# EAGLE design 2016 Vehicle Pedal and Dash Controller (EAGLE 7.6.0)
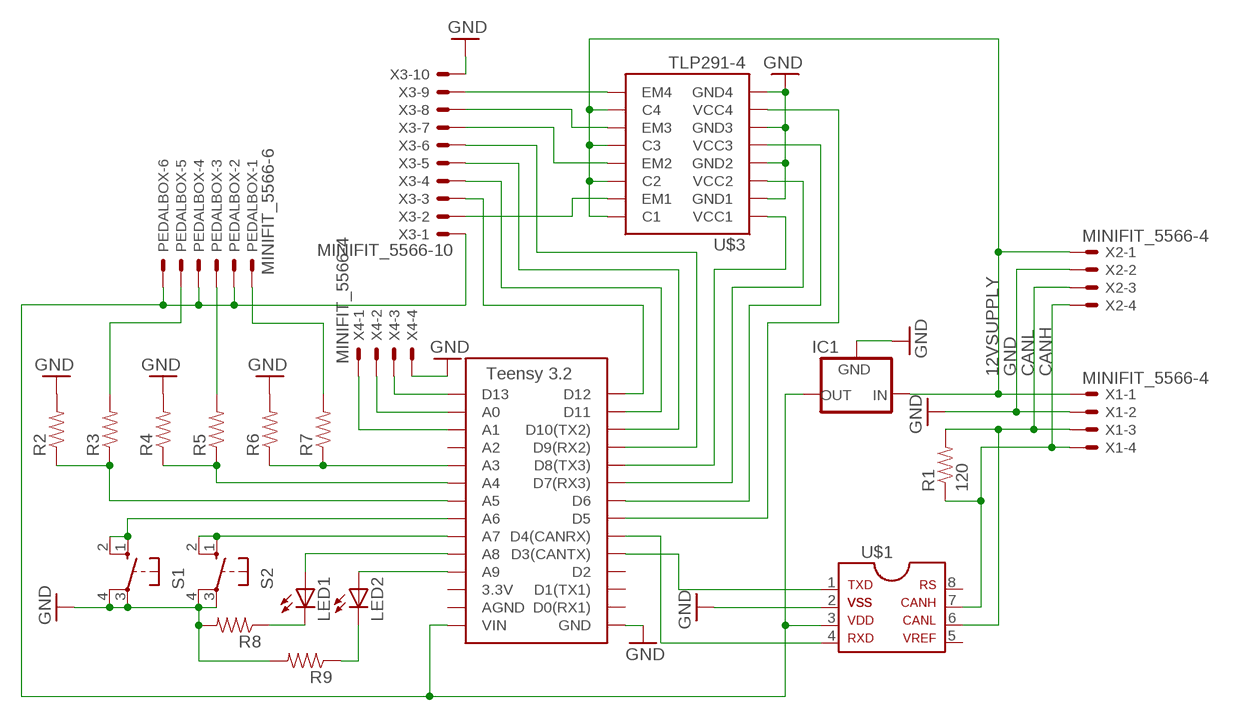
[diagram p0: schematic, sheet 1]

## Parts
IC1  5V_REGULATOR_LM340-NLM340MPX-5.0/NOPB  [SOT223]
LED1  LED-0805  [LED-805]
LED2  LED-0805  [LED-805]
PEDALBOX  MINIFIT_5566-6  [MINIFIT_5566-6]
R1  120  RESISTOR0805-RES  [0805]
R2  RESISTOR0805-RES  [0805]
R3  RESISTOR0805-RES  [0805]
R4  RESISTOR0805-RES  [0805]
R5  RESISTOR0805-RES  [0805]
R6  RESISTOR0805-RES  [0805]
R7  RESISTOR0805-RES  [0805]
R8  RESISTOR0805-RES  [0805]
R9  RESISTOR0805-RES  [0805]
S1  BTN_10-XX  [B3F-10XX]
S2  BTN_10-XX  [B3F-10XX]
U$1  MCP2551  [SOIC-08]
U$2  TEENSY_3.2_SIMPLE  [TEENSY_3.2_SIMPLE]
U$3  TLP291-4  [SOIC-16]
X1  MINIFIT_5566-4  [MINIFIT_5566-4]
X2  MINIFIT_5566-4  [MINIFIT_5566-4]
X3  MINIFIT_5566-10  [MINIFIT_5566-10]
X4  MINIFIT_5566-4  [MINIFIT_5566-4]

## Nets
12VSUPPLY: IC1.1(IN) U$3.10(C4) U$3.12(C3) U$3.14(C2) U$3.16(C1) X1.1 X2.1
CANH: R1.1 U$1.7 X1.4 X2.4
CANL: R1.2 U$1.6 X1.3 X2.3
GND: IC1.2(GND) IC1.4(GND) R2.2 R4.2 R6.2 R8.2 R9.2 S1.3(P) S1.4(P1) S2.3(P) S2.4(P1) U$1.2 U$2.GND U$3.2(GND1) U$3.4(GND2) U$3.6(GND3) U$3.8(GND4) X1.2 X2.2 X3.10 X4.4
N$1: U$2.D12 X3.3
N$2: IC1.3(OUT) PEDALBOX.2 PEDALBOX.4 PEDALBOX.6 U$1.3 U$2.VIN X3.1
N$3: PEDALBOX.5 R3.2
N$4: PEDALBOX.3 R5.2
N$5: U$1.1 U$2.D3(CANTX)
N$6: U$1.4 U$2.D4(CANRX)
N$7: PEDALBOX.1 R7.2
N$8: R2.1 R3.1 U$2.A5
N$9: R4.1 R5.1 U$2.A4
N$10: R6.1 R7.1 U$2.A3
N$11: U$2.D11 X3.4
N$12: U$2.D10(TX2) X3.5
N$13: U$2.D9(RX2) X3.6
N$14: U$2.D8(TX3) U$3.1(VCC1)
N$15: U$3.9(EM4) X3.9
N$16: U$3.11(EM3) X3.8
N$17: U$3.13(EM2) X3.7
N$18: U$3.15(EM1) X3.2
N$19: U$2.D7(RX3) U$3.3(VCC2)
N$20: U$2.D6 U$3.5(VCC3)
N$21: U$2.D5 U$3.7(VCC4)
N$22: S1.1(S) S1.2(S1) U$2.A6
N$23: S2.1(S) S2.2(S1) U$2.A7
N$24: LED1.A U$2.A8
N$25: LED2.A U$2.A9
N$26: LED1.C R8.1
N$27: LED2.C R9.1
N$28: U$2.D13 X4.3
N$29: U$2.A0 X4.2
N$30: U$2.A1 X4.1
Unconnected: U$1.5 U$1.8 U$2.3.3V U$2.A2 U$2.AGND U$2.D0(RX1) U$2.D1(TX1) U$2.D2

## Library data of the parts
IC1 = HyTechDevices:5V_REGULATOR_LM340-N: Voltage Regulator 5v linear voltage regulator Datasheet <http://www.mouser.com/ProductDetail/Texas-Instruments/LM340MPX-50-NOPB/?qs=X1J7HmVL2ZGZwtTFRQ9ItA%3D%3D> MAX current out: 1.5A MAX voltage in: 35V
LED1 LED2 = HyTechDevices:LED: Light Emitting Diode Source: Dangerous Prototypes Eagle Library <https://github.com/DangerousPrototypes/Eagle_Part_Library>
PEDALBOX = HyTechDevices:MINIFIT_5566-6: Mini FIT Junior connector 6 pole Source: http://www.molex.com; MPN: 95566-61002; OC_FARNELL: unknown; OC_NEWARK: 22K8620
R1-R9 = HyTechDevices:RESISTOR: Resistor Basic schematic elements and footprints for 0603, 1206, and PTH resistors.
S1 S2 = HyTechDevices:BTN_10-XX: OMRON SWITCH; MPN: B3F-1000; OC_FARNELL: 176432; OC_NEWARK: 36M3542
U$1 = HyTechDevices:MCP2551: MCP2551 High-Speed CAN Transceiver Product Webpage <https://www.microchip.com/wwwproducts/en/MCP2551> Datasheet <http://ww1.microchip.com/downloads/en/DeviceDoc/21667f.pdf> This device is outdated It is replaced by MCP2561. Comparison Page <https://www.microchip.com/wwwproducts/ProductCompare/MCP2551/MCP2561> Product Webpage <https://www.microchip.com/wwwproducts/en/MCP2561> Datasheet <http://ww1.microchip.com/downloads/en/DeviceDoc/20005167C.pdf>
U$2 = HyTechDevices:TEENSY_3.2_SIMPLE: Simple version of the Teensy 3.2 board that only uses the 2 main rows of pins, not the inner pins or the pins opposite the usb port.
U$3 = HyTechDevices:TLP291-4: Toshiba Quad Channel Optocoupler TLP291-4
X1 X2 X4 = HyTechDevices:MINIFIT_5566-4: Mini FIT Junior connector 4 pole Source: http://www.molex.com; OC_FARNELL: unknown; OC_NEWARK: unknown
X3 = HyTechDevices:MINIFIT_5566-10: Mini FIT Junior connector 10 pole Source: http://www.molex.com; OC_FARNELL: unknown; OC_NEWARK: unknown

## Board
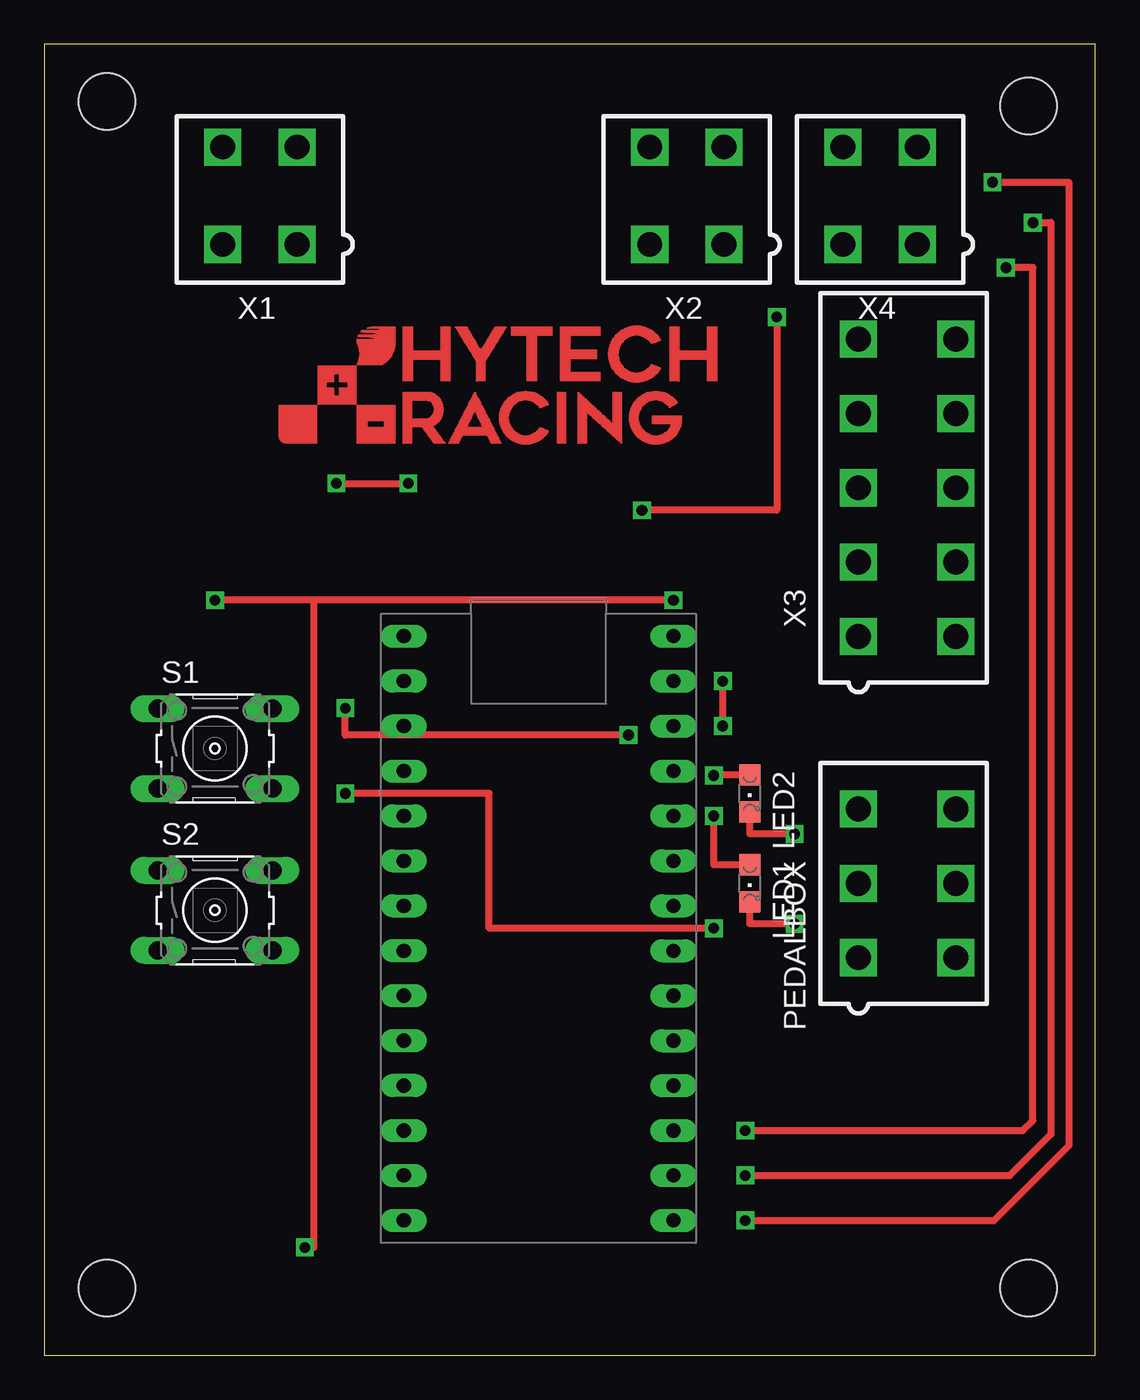
[diagram p1: board, top side]
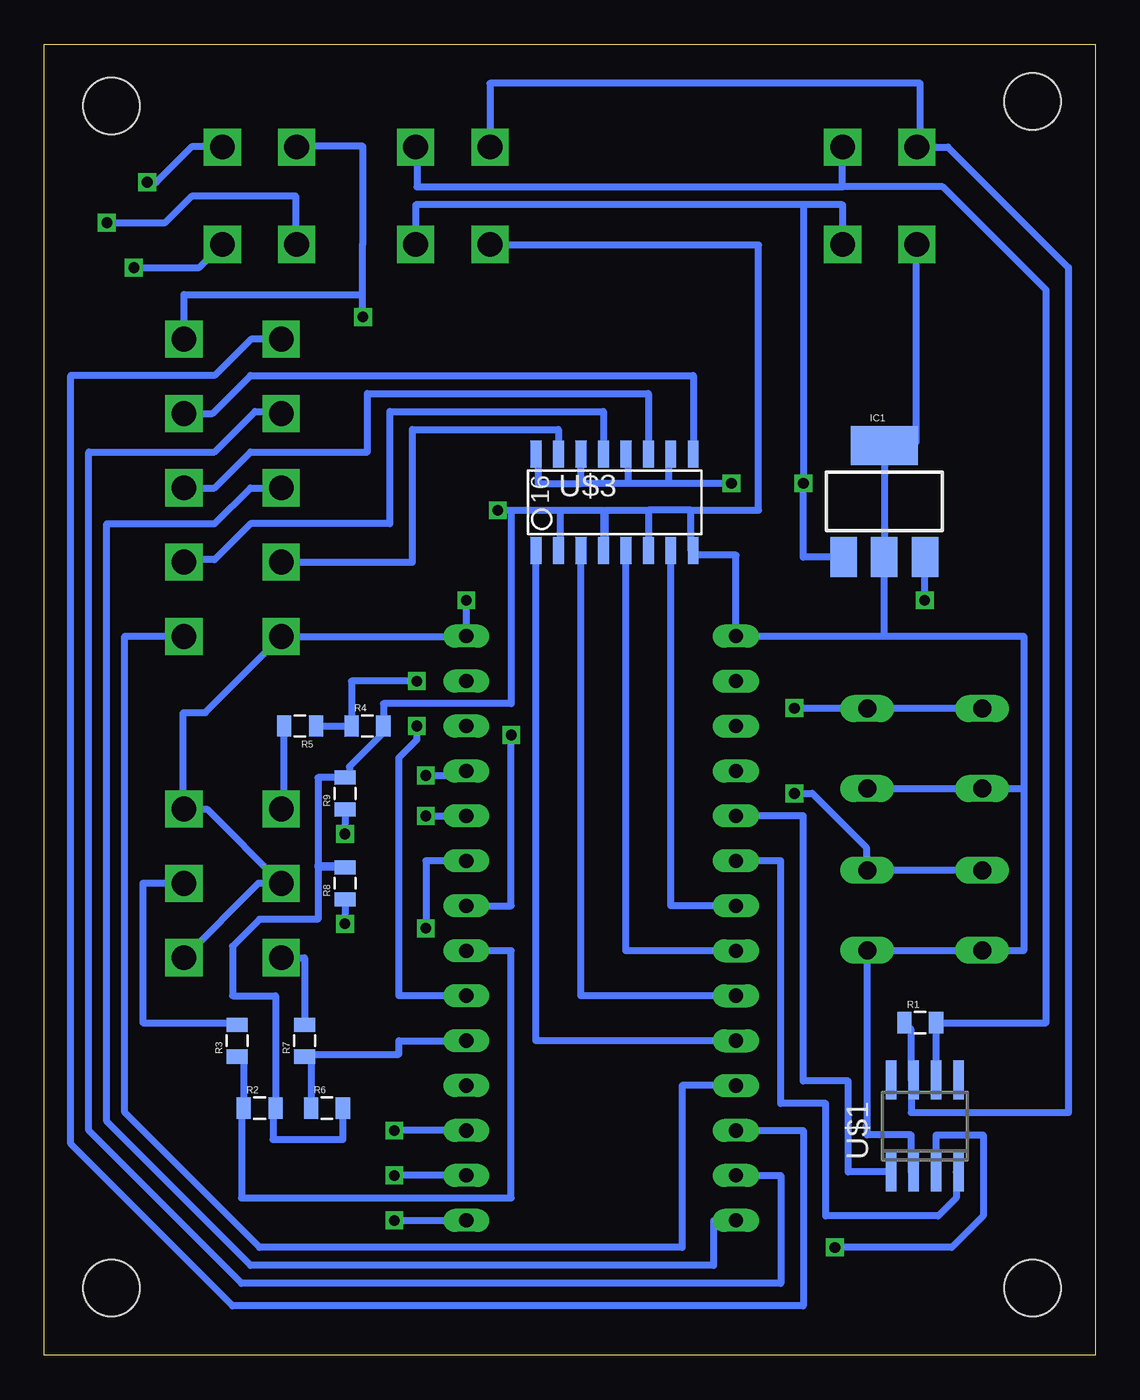
[diagram p2: board, bottom side, seen from below]

Size 59.42 x 74.09 mm. Coordinates in mm from the lower left corner, seen from the top.
Outline: 0,0 59.42,0 59.42,74.09 0,74.09 0,0
Copper layers (1*16): Top 0.035mm / dielectric 1.5mm / Bottom 0.035mm
Design rules "default": minimum track width 10mil, minimum drill 24mil, track to track 8mil, track to pad 8mil, pad to pad 8mil, via to via 8mil, smd to smd 8mil, copper to edge 40mil, drill to drill 8mil, minimum pad ring 10mil, minimum via ring 8mil, stop-mask expansion 4mil, vias tented up to drill 0mil, thermal gap 10mil
Holes 3.2 mm at 3.56,70.87 3.56,3.81 55.63,3.81 55.63,70.61

### Footprints (pad centres in the part's own frame; a part is rotated, then mirrored left to right if it is on the bottom)
SOT223 = smd 1.5 x 2.235: 1 -2.3,-3.15; 2 0,-3.15; 3 2.3,-3.15 | smd 3.8 x 2.2: 4 0,3.15
LED-805 = smd 1.2 x 1.2: A 0,-1.05; C 0,1.05
MINIFIT_5566-6 = drill 1.4 square: 1 4.2,-2.75; 2 0,-2.75; 3 -4.2,-2.75; 4 4.2,2.75; 5 0,2.75; 6 -4.2,2.75
0805 = smd 0.8 x 1.2: 1 -0.9,0; 2 0.9,0
B3F-10XX = drill 1.016 long: 1 -3.251,2.261; 2 3.251,2.261; 3 -3.251,-2.261; 4 3.251,-2.261
SOIC-08 = smd 0.6 x 2.2: 1 -1.905,-2.6; 2 -0.635,-2.6; 3 0.635,-2.6; 4 1.905,-2.6; 5 1.905,2.6; 6 0.635,2.6; 7 -0.635,2.6; 8 -1.905,2.6
TEENSY_3.2_SIMPLE = drill 0.8 long: 3.3V 16.51,29.21; A0 16.51,3.81; A1 16.51,6.35; A2 16.51,8.89; A3 16.51,11.43; A4 16.51,13.97; A5 16.51,16.51; A6 16.51,19.05; A7 16.51,21.59; A8 16.51,24.13; A9 16.51,26.67; AGND 16.51,31.75; D0(RX1) 1.27,31.75; D1(TX1) 1.27,29.21; D2 1.27,26.67; D3(CANTX) 1.27,24.13; D4(CANRX) 1.27,21.59; D5 1.27,19.05; D6 1.27,16.51; D7(RX3) 1.27,13.97; D8(TX3) 1.27,11.43; D9(RX2) 1.27,8.89; D10(TX2) 1.27,6.35; D11 1.27,3.81; D12 1.27,1.27; D13 16.51,1.27; GND 1.27,34.29; VIN 16.51,34.29
SOIC-16 = smd 0.61 x 1.524: 1 -4.445,-2.794; 2 -3.175,-2.794; 3 -1.905,-2.794; 4 -0.635,-2.794; 5 0.635,-2.794; 6 1.905,-2.794; 7 3.175,-2.794; 8 4.445,-2.794; 9 4.445,2.667; 10 3.175,2.667; 11 1.905,2.667; 12 0.635,2.667; 13 -0.635,2.667; 14 -1.905,2.667; 15 -3.175,2.667; 16 -4.445,2.667
MINIFIT_5566-4 = drill 1.4 square: 1 2.1,-2.75; 2 -2.1,-2.75; 3 2.1,2.75; 4 -2.1,2.75
MINIFIT_5566-10 = drill 1.4 square: 1 8.4,-2.75; 2 4.2,-2.75; 3 0,-2.75; 4 -4.2,-2.75; 5 -8.4,-2.75; 6 8.4,2.75; 7 4.2,2.75; 8 0,2.75; 9 -4.2,2.75; 10 -8.4,2.75

### Placement (x,y rotation side)
IC1  11.94,48.26 0 bottom
LED1  39.88,26.67 180 top
LED2  39.88,31.75 180 top
PEDALBOX  48.77,26.67 270 top
R1  9.91,18.8 0 bottom
R2  47.24,13.97 0 bottom
R3  48.51,17.78 90 bottom
R4  41.15,35.56 0 bottom
R5  44.96,35.56 180 bottom
R6  43.43,13.97 0 bottom
R7  44.7,17.78 90 bottom
R8  42.42,26.67 90 bottom
R9  42.42,31.75 90 bottom
S1  9.65,34.29 0 top
S2  9.65,25.15 0 top
U$1  9.65,12.95 0 bottom
U$2  19.05,6.35 0 top
U$3  27.18,48.26 0 bottom
X1  12.19,65.53 0 top
X2  36.32,65.53 0 top
X3  48.77,49.02 270 top
X4  47.24,65.53 0 top

### Tracks (layer width: path | path; a pad name or v marks a point on that pad's centre or on a via)
12VSUPPLY  (via drill 0.6)
  Top 0.406: v16.51,49.28 v20.57,49.28
  Bottom 0.406: 16.51,65.02 38.42,65.02 X2.1 | U$3.16 31.5,50.93 31.5,49.28 29.08,49.28 | 29.08,49.28 U$3.14 | U$3.12 26.42,50.93 26.42,49.28 | 26.42,49.28 29.08,49.28 | U$3.10 24.13,50.93 24.13,49.28 | 24.13,49.28 26.42,49.28 | IC1.1 16.51,45.11 v16.51,49.28 16.51,65.02 | v20.57,49.28 24.13,49.28 | 16.51,65.02 14.29,65.02 X1.1
CANH
  Bottom 0.406: 9.91,68.28 9.91,71.88 34.22,71.88 X2.4 | 10.41,15.55 10.41,18.4 R1.1 | U$1.7 10.41,15.55 | 10.41,15.55 10.41,13.72 1.52,13.72 1.52,61.47 8.34,68.28 9.91,68.28 | X1.4 9.91,68.28
CANL
  Bottom 0.406: X2.3 38.35,68.28 38.35,66.04 14.29,66.04 | 14.29,66.04 X1.3 | U$1.6 9.01,15.55 R1.2 2.79,18.8 2.79,60.2 8.64,66.04 14.29,66.04
GND  (via drill 0.6)
  Top 0.406: v41.4,58.67 41.4,47.75 v33.78,47.75
  Bottom 0.406: 22.86,47.75 22.86,45.47 U$3.8 22.73,45.21 20.32,45.21 U$2.GND 11.94,40.64 | 22.86,47.75 25.27,47.75 | 25.27,47.75 U$3.6 | U$3.2 30.23,45.47 30.23,47.75 | 30.23,47.75 27.81,47.75 U$3.4 27.69,45.47 27.69,47.75 25.27,47.75 | 33.97,47.75 v33.78,47.75 33.02,47.75 | X1.2 10.16,62.78 10.16,51.56 11.94,51.56 IC1.4 IC1.2 11.94,40.64 | S2.4 S2.3 6.4,22.86 4.06,22.86 4.06,32.03 | S1.4 S1.3 4.06,32.03 | 33.02,47.75 30.23,47.75 | R6.2 42.53,12.19 46.48,12.19 46.48,13.97 R2.2 46.34,20.32 48.77,20.32 48.77,23.11 47.24,24.64 43.94,24.64 43.94,27.57 R8.2 42.42,27.69 43.94,27.69 43.94,32.65 R9.2 | 22.86,47.75 19.05,47.75 19.05,62.74 34.22,62.74 X2.2 | 33.02,47.75 33.02,36.83 40.25,36.83 R4.2 40.13,35.44 40.13,35.31 42.16,33.27 42.16,32.9 R9.2 | U$1.2 10.41,10.35 10.41,12.45 12.9,12.45 | 12.9,22.86 S2.4 | 12.95,12.95 12.9,12.45 | 12.9,12.45 S2.4 | 11.94,40.64 4.06,40.64 4.06,32.03 | R9.2 42.03,32.65 | 41.45,59.94 41.45,62.78 41.4,62.78 41.4,68.33 45.14,68.33 X4.4 | 41.45,59.94 41.45,58.72 v41.4,58.67 | X3.10 51.52,59.94 41.45,59.94
N$1
  Bottom 0.406: U$2.D12 21.59,7.62 21.59,5.08 47.75,5.08 55.88,13.21 55.88,46.99 49.78,46.99 47.75,49.02 X3.3
N$2  (via drill 0.6)
  Top 0.406: v35.56,42.67 15.24,42.67 | 15.24,42.67 v9.65,42.67 | v14.73,6.1 15.24,6.1 15.24,42.67
  Bottom 0.406: PEDALBOX.4 47.32,26.67 PEDALBOX.2 50.22,30.87 PEDALBOX.6 51.56,30.87 51.56,36.32 50.32,36.32 X3.1 34.8,40.62 U$2.VIN v35.56,42.67 | U$1.3 9.02,12.45 6.35,12.45 6.35,7.87 8.13,6.1 v14.73,6.1 | v9.65,42.67 9.64,42.67 IC1.3
N$3
  Bottom 0.406: PEDALBOX.5 53.85,26.67 53.85,18.8 48.51,18.8 R3.2
N$4
  Bottom 0.406: PEDALBOX.3 45.86,30.87 R5.2
N$5
  Bottom 0.406: U$1.1 13.97,10.35 13.97,15.49 16.51,15.49 16.51,30.48 U$2.D3(CANTX)
N$6
  Bottom 0.406: U$1.4 7.87,10.35 7.87,8.89 8.89,7.87 15.24,7.87 15.24,14.22 17.78,14.22 17.78,27.94 U$2.D4(CANRX)
N$7
  Bottom 0.406: PEDALBOX.1 44.7,22.47 R7.2
N$8
  Bottom 0.406: R3.1 48.14,16.88 R2.1 48.26,13.97 48.26,8.89 33.02,8.89 33.02,22.86 U$2.A5
N$9  (via drill 0.6)
  Top 0.406: v38.35,35.56 v38.35,38.1
  Bottom 0.406: R5.1 R4.1 42.05,38.1 v38.35,38.1 | v38.35,35.56 38.35,34.8 39.37,33.78 39.37,20.32 U$2.A4
N$10
  Bottom 0.406: R7.1 44.33,16.88 | 44.33,16.88 R6.1 | 44.33,16.88 44.33,17.02 39.37,17.02 39.37,17.78 U$2.A3
N$11
  Bottom 0.406: U$2.D11 17.78,10.16 17.78,4.06 48.26,4.06 56.9,12.7 56.9,51.05 49.78,51.05 47.5,53.34 46.14,53.34 X3.4
N$12
  Bottom 0.406: U$2.D10(TX2) 16.51,12.7 16.51,2.79 48.77,2.79 57.91,11.94 57.91,55.37 49.78,55.37 47.73,57.42 X3.5
N$13
  Bottom 0.406: U$2.D9(RX2) 23.37,15.24 23.37,6.1 47.24,6.1 54.86,13.72 54.86,40.64 51.52,40.64 X3.6
N$14
  Bottom 0.406: U$2.D8(TX3) 31.62,17.78 U$3.1
N$15
  Bottom 0.406: U$3.9 22.73,55.37 47.75,55.37 49.9,53.22 X3.9
N$16
  Bottom 0.406: U$3.11 25.27,54.36 41.15,54.36 41.15,51.05 47.75,51.05 49.78,49.02 X3.8
N$17
  Bottom 0.406: 51.56,44.82 X3.7 51.38,44.96 49.78,44.96 47.75,46.99 39.88,46.99 39.88,53.34 27.81,53.34 U$3.13
N$18
  Bottom 0.406: X3.2 38.61,44.82 38.61,52.32 30.35,52.32 U$3.15
N$19
  Bottom 0.406: U$2.D7(RX3) 29.08,20.32 U$3.3
N$20
  Bottom 0.406: U$2.D6 26.54,22.86 U$3.5
N$21
  Bottom 0.406: U$2.D5 24,25.4 U$3.7
N$22  (via drill 0.6)
  Top 0.406: v33.02,35.05 17.02,35.05 v17.02,36.58
  Bottom 0.406: S1.1 S1.2 12.9,36.58 v17.02,36.58 | U$2.A6 33.02,25.4 v33.02,35.05
N$23  (via drill 0.6)
  Top 0.406: v37.85,24.13 25.15,24.13 25.15,31.75 v17.02,31.75
  Bottom 0.406: S2.1 S2.2 12.95,27.46 12.95,28.7 16,31.75 v17.02,31.75 | U$2.A7 37.85,27.94 v37.85,24.13
N$24  (via drill 0.6)
  Top 0.406: LED1.A 37.85,27.72 v37.85,30.48
  Bottom 0.406: v37.85,30.48 U$2.A8
N$25  (via drill 0.6)
  Top 0.406: LED2.A 37.85,32.8 v37.85,32.77
  Bottom 0.406: v37.85,32.77 35.56,32.77 U$2.A9
N$26  (via drill 0.6)
  Top 0.406: v42.42,24.38 39.88,24.38 LED1.C
  Bottom 0.406: R8.1 v42.42,24.38
N$27  (via drill 0.6)
  Top 0.406: v42.42,29.46 39.88,29.46 LED2.C
  Bottom 0.406: R9.1 v42.42,29.46
N$28  (via drill 0.6)
  Top 0.406: v53.59,66.29 57.91,66.29 57.91,11.84 53.7,7.62 v39.62,7.62
  Bottom 0.406: v39.62,7.62 U$2.D13 | v53.59,66.29 53.09,66.29 51.05,68.33 49.39,68.33 X4.3
N$29  (via drill 0.6)
  Top 0.406: v55.88,64.01 56.9,64.01 56.9,12.47 54.58,10.16 v39.62,10.16
  Bottom 0.406: U$2.A0 v39.62,10.16 | v55.88,64.01 52.58,64.01 51.05,65.53 45.21,65.53 45.21,62.85 X4.2
N$30  (via drill 0.6)
  Top 0.406: v54.36,61.47 55.88,61.47 55.88,13.26 55.32,12.7 v39.62,12.7
  Bottom 0.406: U$2.A1 v39.62,12.7 | v54.36,61.47 50.66,61.47 X4.1
(copper drawn outside any net)
  shapes: Top area x2493